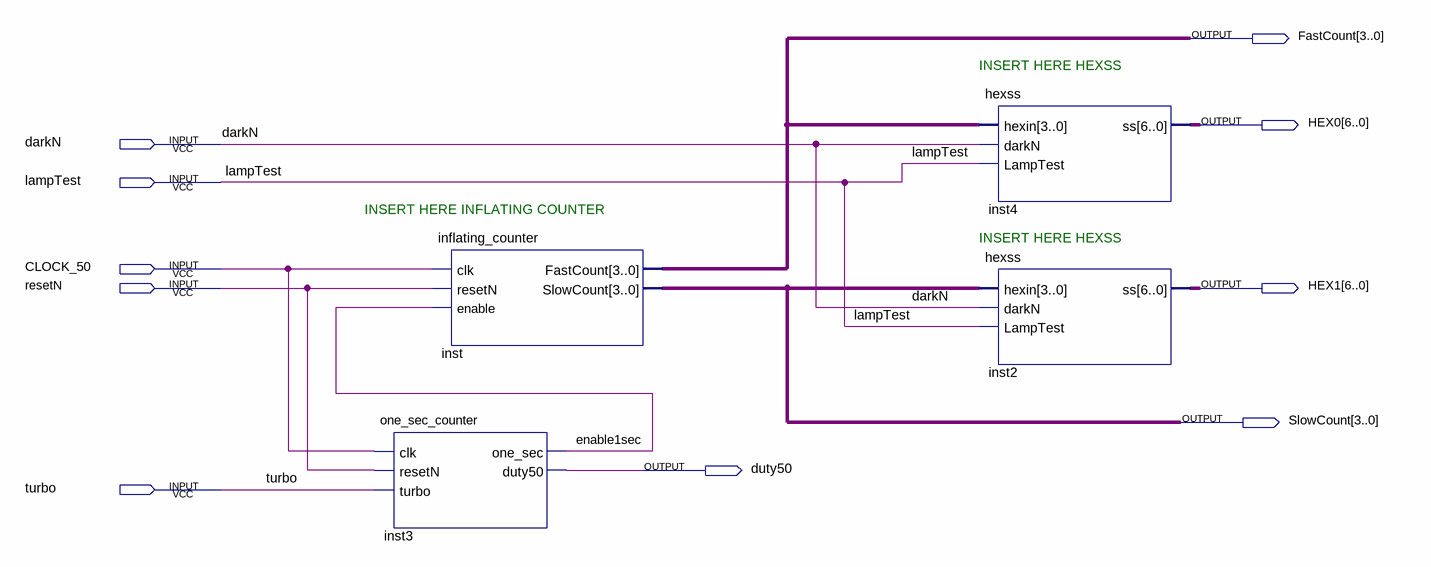
[diagram p0: schematic sheet]
// Quartus schematic inflating_cnt_top.bdf as structural Verilog: 4 symbols, 10 pins
module inflating_cnt_top (
  input  darkN,
  input  lampTest,
  input  CLOCK_50,
  input  resetN,
  input  turbo,
  output [3:0] FastCount,
  output [6:0] HEX0,
  output [6:0] HEX1,
  output [3:0] SlowCount,
  output duty50
);

  wire enable1sec;

  one_sec_counter inst3 (.clk(CLOCK_50), .resetN(resetN), .turbo(turbo), .one_sec(enable1sec), .duty50(duty50));
  inflating_counter inst (
    .clk(CLOCK_50), .resetN(resetN), .enable(enable1sec), .FastCount(FastCount), .SlowCount(SlowCount));
  hexss inst4 (.hexin(FastCount), .darkN(darkN), .LampTest(lampTest), .ss(HEX0));
  hexss inst2 (.hexin(SlowCount), .darkN(darkN), .LampTest(lampTest), .ss(HEX1));

  // Notes on the sheet:
  //   INSERT HERE HEXSS
  //   INSERT HERE INFLATING COUNTER
  //   INSERT HERE HEXSS
endmodule
